# Altium project Tile-carrier.PrjPcb
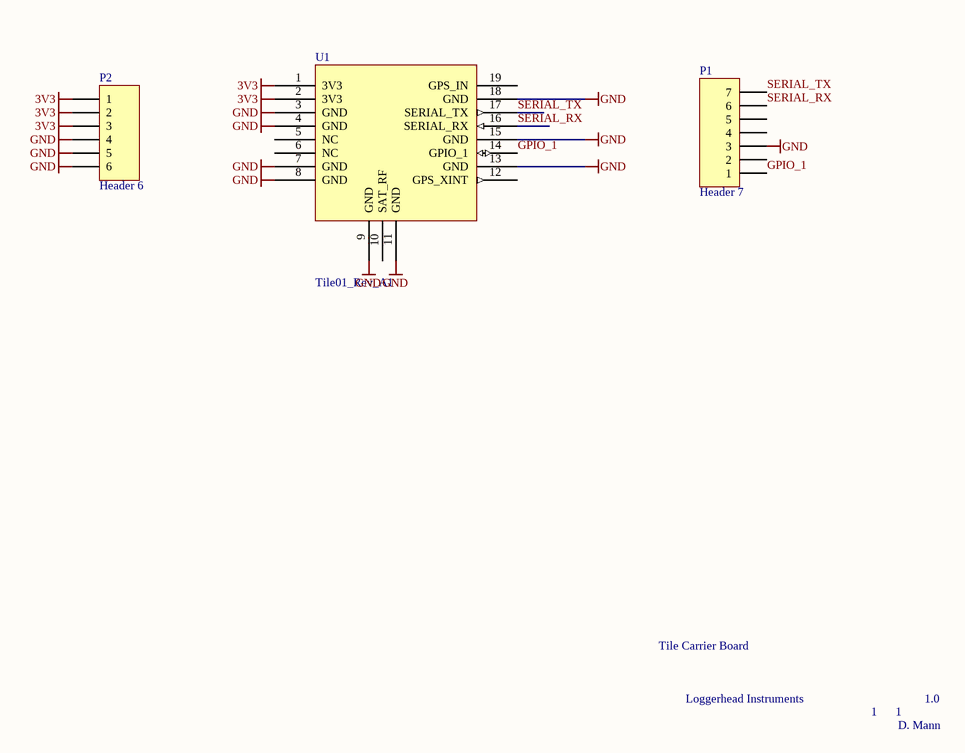
[diagram p0: Tile-carrier.SchDoc]
1 sheet, 3 parts. Net scope: global (net labels, ports and power ports of the same name join across sheets).
Board file: Tile-carrier.PcbDoc

## Sheet Tile-carrier.SchDoc
size A; SheetNumber: 1; SheetTotal: 1

### Parts
P1  Header 7  [HDR1X7]
P2  Header 6  [HDR1X6]
U1  MANUF1 P/N: Tile01_Rev_A1  [Tile01 Rev A1]

### Nets
3V3: P2.1 P2.2 P2.3 U1.1(3V3) U1.2(3V3)
GND: P1.3 P2.4 P2.5 P2.6 U1.3(GND) U1.4(GND) U1.7(GND) U1.8(GND) U1.9(GND) U1.11(GND) U1.13(GND) U1.15(GND) U1.18(GND)
GPIO_1: P1.1 U1.14(GPIO_1)
SERIAL_RX: P1.6 U1.16(SERIAL_RX)
SERIAL_TX: P1.7 U1.17(SERIAL_TX)

Not connected (* = marked no-connect by the designer): P1 2 4 5; U1 5(NC) 6(NC) 10(SAT_RF) 12(GPS_XINT) 19(GPS_IN)

### Notes on the sheet
- Tile Carrier Board
- Loggerhead Instruments
- 1
- 1.0
- D. Mann

### Library data of the parts
P1 = Header 7: Header, 7-Pin; LatestRevisionDate: 17-Jul-2002; LatestRevisionNote: Re-released for DXP Platform.; Publisher: Altium Limited
P2 = Header 6: Header, 6-Pin; LatestRevisionDate: 17-Jul-2002; LatestRevisionNote: Re-released for DXP Platform.; Publisher: Altium Limited
U1 = Tile01 Rev A1: SWARM: Tile01 Rev A1 VHF; MANUF1: SWARM; Voltage: 3V3; TEMP: -40°C ~ 85°C (TA); Size: MOD; Supplier: Swarm; Value: VHF